# Altium schematic sheet Interfaces.SchDoc
size A; SheetNumber: 2; SheetTotal: 3
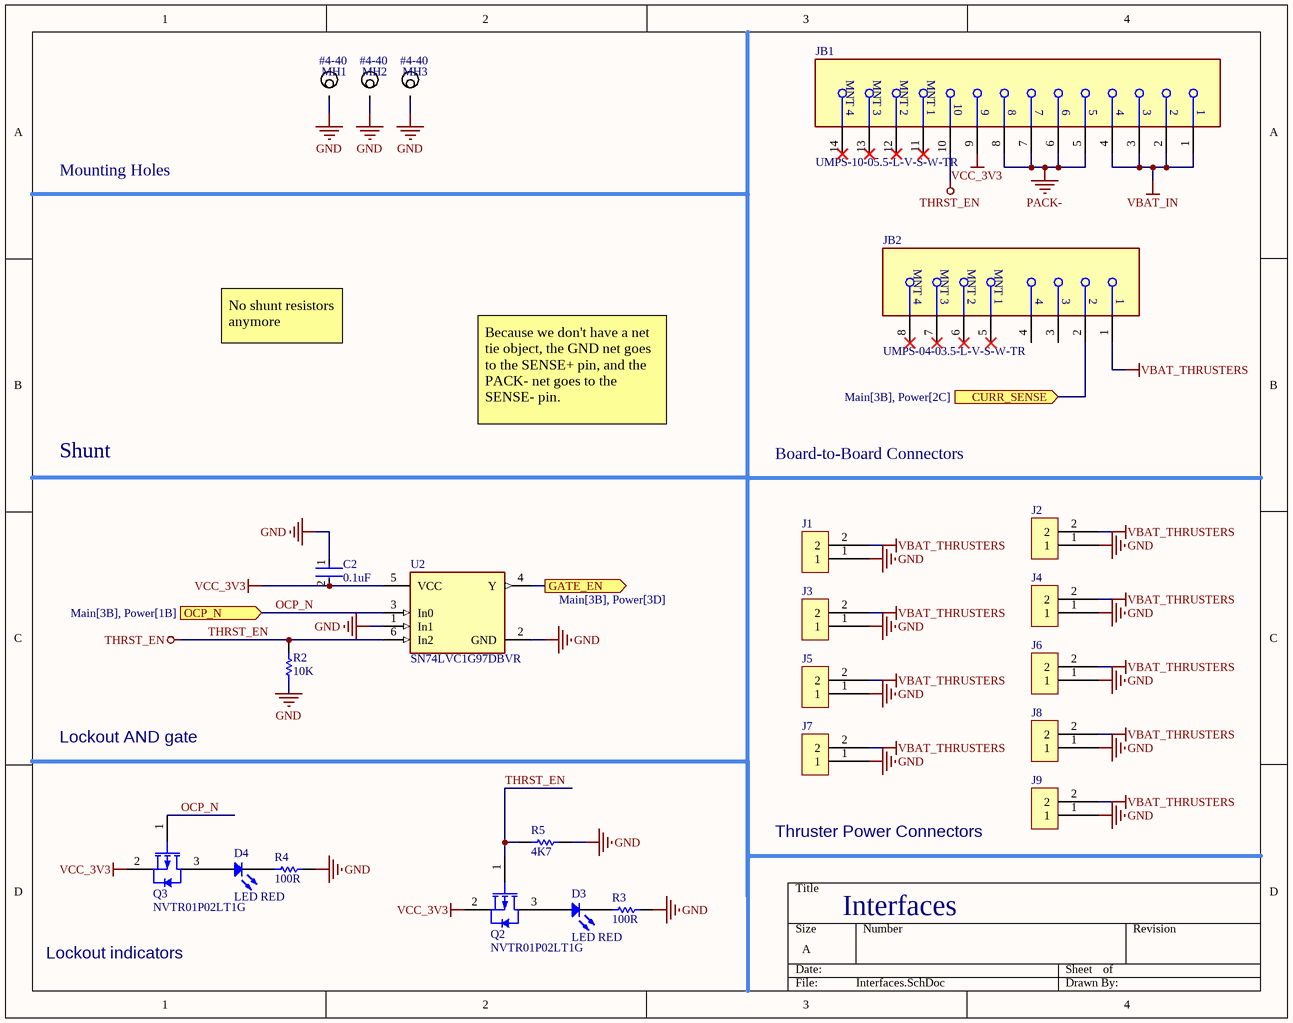
[diagram p0: Interfaces.SchDoc]

## Parts
C2  0.1uF  [FP-C0603C-CF-MFG]
D3  LED RED  [C0805]
D4  LED RED  [C0805]
J1  (no value)  [2-pin Megafit RA]
J2  (no value)  [2-pin Megafit RA]
J3  (no value)  [2-pin Megafit RA]
J4  (no value)  [2-pin Megafit RA]
J5  (no value)  [2-pin Megafit RA]
J6  (no value)  [2-pin Megafit RA]
J7  (no value)  [2-pin Megafit RA]
J8  (no value)  [2-pin Megafit RA]
J9  (no value)  [2-pin Megafit RA]
JB1  UMPS-10-05.5-L-V-S-W-TR  [FP-UMPS-10-05_5-L-V-S-W-T-MFG]
JB2  UMPS-04-03.5-L-V-S-W-TR  [FP-UMPS-04-03_5-L-V-S-W-T-MFG]
MH1  #4-40  [Mounting Hole #4-40]
MH2  #4-40  [Mounting Hole #4-40]
MH3  #4-40  [Mounting Hole #4-40]
Q2  NVTR01P02LT1G  [ONSC-SOT-23-3-318-08_V]
Q3  NVTR01P02LT1G  [ONSC-SOT-23-3-318-08_V]
R2  10K  [RESC0603(1608)_N]
R3  100R  [RESC1609X50X30NL10T20]
R4  100R  [RESC1609X50X30NL10T20]
R5  4K7  [0603]
U2  SN74LVC1G97DBVR  [FP-DBV0006A-MFG]

## Ports
CURR_SENSE (in, see Main[3B], Power[2C]), GATE_EN (out, see Main[3B], Power[3D]), OCP_N (in, see Main[3B], Power[1B])

## Nets
GND: C2.1 J1.1 J2.1 J3.1 J4.1 J5.1 J6.1 J7.1 J8.1 J9.1 MH1.0 MH2.0 MH3.0 R2.2 R3.2 R4.2 R5.1 U2.1(In1) U2.2(GND)
PACK-: JB1.5 JB1.6 JB1.7 JB1.8
THRST_EN: JB1.10 Q2.1(G) R2.1 R5.2 U2.6(In2)
VBAT_IN: JB1.1 JB1.2 JB1.3 JB1.4
VBAT_THRUSTERS: J1.2 J2.2 J3.2 J4.2 J5.2 J6.2 J7.2 J8.2 J9.2 JB2.1
VCC_3V3: C2.2 JB1.9 Q2.2(S) Q3.2(S) U2.5(VCC)
CURR_SENSE: JB2.2 ; port CURR_SENSE
GATE_EN: U2.4(Y) ; port GATE_EN
OCP_N: Q3.1(G) U2.3(In0) ; port OCP_N
NetD3_1: D3.1(K) R3.1
NetD3_2: D3.2(A) Q2.3(D)
NetD4_1: D4.1(K) R4.1
NetD4_2: D4.2(A) Q3.3(D)

Not connected (* = marked no-connect by the designer): JB1 11(MNT_1)* 12(MNT_2)* 13(MNT_3)* 14(MNT_4)*; JB2 3 4 5(MNT_1)* 6(MNT_2)* 7(MNT_3)* 8(MNT_4)*

## Notes on the sheet
- Mounting Holes
- No shunt resistors anymore
- Because we don't have a net tie object, the GND net goes to the SENSE+ pin, and the PACK- net goes to the SENSE- pin.
- Shunt
- Board-to-Board Connectors
- Lockout AND gate
- Thruster Power Connectors
- Lockout indicators
- Interfaces

## Library data of the parts
C2 = CMP-1035-02580-3: CAP CER 0.1UF 10V X7R 0603; Manufacturer Part Number: C0603C104K8RACTU; Manufacturer: KEMET; Tolerance: 0.1; Value: 0.10 μF; Material: Ceramic; Temperature Coefficient: 30ppm/°C; Automotive Grade: Grade 1; Digikey Description: CAP CER 0.1UF 10V X7R 0603; Temperature Range High: +125°C; RoHS: TRUE; ComponentLink2URL: https://api.kemet.com/component-edge/download/datasheet/C0603C100J5GACAUTO.pdf; Lead Free: Yes; Device Class L2: Capacitors; Mouser Description: Multilayer Ceramic Capacitors MLCC - SMD/SMT 10volts 0.1uF X7R 10%; Temperature: -55°C to +125°C; Category: Cap; Height: 0.87mm; Voltage Rating: 10 V; Device Class L3: Ceramic Capacitors; ComponentLink2Description: Datasheet; Automotive: Yes; Octopart: https://octopart.com/c0603c104k8ractu-kemet-145075; Temperature Characteristic: X7R; Device Class L1: Passive Components; Temperature Range Low: -55°C; Package: C0603C-CF; Capacitance: 0.10 μF
D3 D4 = LED0: led / LTST-C171KRKT; Manufacturer: Lite-On Inc.; Lens Color: Colorless; Lens Transparency: Clear; Millicandela Rating: 54mcd; Lens Style/Size: Rectangle with Flat Top, 1.40mm x 1.25mm; Voltage - Forward (Vf) (Typ): 2V; Current - Test: 20mA; Viewing Angle: 130°; Wavelength - Dominant: 631nm; Wavelength - Peak: 639nm; Supplier 1: Digi-Key; Supplier Part Number 1: 160-1427-1-ND; Manufacturer Part Number: LTST-C171KRKT; RoHS: RoHS Compliant; Category: Optoelectronics; Stock 1: 260544; Pricing 1: 1=0.31, 10=0.225, 25=0.1656, 100=0.1183, 250=0.0804, 500=0.07096, 1000=0.05558 (USD); Packaging: Cut Tape (CT); Part Status: Active; Color: Red; Mounting Type: Surface Mount; Features: -; Package / Case: 0805 (2012 Metric); Size / Dimension: 2.00mm L x 1.25mm W; Height (Max): 0.80mm; ComponentLink1URL: http://optoelectronics.liteon.com/upload/download/DS22-2000-109/LTST-C171KRKT.pdf; ComponentLink1Description: http://optoelectronics.liteon.com/upload/download/DS22-2000-109/LTST-C171KRKT.pdf
J1-J9 = 2-pin megafit
JB1 = CMP-02770-000036-1: CONN MPOWER 2MM FMALE 10POS GOLD; System: Connector
JB2 = CMP-02770-000027-1: CONN MPOWER 2MM FMALE 4POS GOLD
MH1-MH3 = Mounting Hole #4-40, Loose Fit: Mounting Hole for ANSI #4-40 w/ Flat Washer, Loose Fit; Datasheet: http://blogs.mentor.com/tom-hausherr/blog/tag/pcb-mounting-holes/
Q2 Q3 = CMP-1058-00752-1: Power MOSFET, -20 V, -1.3 A, P-Channel, 3-Pin SOT-23, Pb-Free, Tape and Reel; Manufacturer: On Semiconductor; Ciss Typ (pF): 225; Configuration: Single; Coss Typ (pF): 130; PD Max (W): 0.4; ID Max (A): 1.3; Crss Typ (pF): 55; VGS Max (V): 12; V(BR)DSS Min (V): 20; VGS(th) Max (V): 1.25; Qrr Typ (nC): 8.5; Channel Polarity: P Channel; ComponentLink1URL: http://www.onsemi.com/; PackageReference: SOT-23-3-318-08; RoHS: Pb-Free; ComponentLink1Description: Manufacturer URL; PackageDescription: 3-Pin Small Outline Transistor, Body 2.92 x 1.3 mm, Pitch 0.95 mm; ComponentLink3Description: Package Specification; ComponentLink2Description: Datasheet; Package Type: SOT-23-3; ComponentLink2URL: http://www.onsemi.cn/pub_link/Collateral/NTR1P02LT1-D.PDF; Packing: Tape and Reel; Mounting Technology: Surface Mount; ComponentLink3URL: http://www.onsemi.cn/pub_link/Collateral/318-08.PDF; PartNumber: NVTR01P02LT1G; PackageVersion: Rev. AP, 11/2009; DatasheetVersion: Rev. 13
R2 = CMP-1012-00098-1: 10K 0.1W 5% 0603 (1608 Metric)  SMD; Case-EIA: 0603; Value: 10000.00 Ohm; Case-Metric: 1608; Technology: SMT; Tolerance: 5 %; Power: 0.1 W
R3 R4 = CMP-1012-00050-2: 100R 0.1W 5%; Part Number: CRCW0603100RJNTA; Manufacturer: Vishay Dale
R5 = 4K7 0603: 4K7 0.1W 1% 0603 (1608 Metric)  SMD; Case-Metric: 1608; Value: 4700.00 Ohm; Case-EIA: 0603; Power: 0.1 W; Tolerance: 1 %; Technology: SMT; ComponentLink1Description: Link; ComponentLink1URL: https://www.digikey.com/en/products/detail/yageo/RC0603FR-074K7L/727212
U2 = CMP-0859-00234-4: IC CONFIG MULT-FUNC GATE SOT23-6; Manufacturer: Texas Instruments; Logic Function Desc: Dual; Min Supply Voltage: 1.65V; Number Of Inputs: 3; Nominal Supply Current: 10uA; Max Supply Voltage: 5.5V; Number Of Circuits: 1; Propagation Delay: 6.1ns; Standoff Height: 0mm; Max Junction Temp: +150°C; Category: IC; Device Class L3: Logic Gates; ComponentLink2Description: Datasheet; Ipc Land Pattern Name: SOT95P280X145-6; RoHS: TRUE; Temperature Range High: +125°C; Octopart: https://octopart.com/sn74lvc1g97dbvr-texas+instruments-464842; Package: DBV0006A; Device Class L2: Logic ICs; Temperature Range Low: -40°C; Ambient Temperature Range High: +125°C; Height: 1.45mm; Automotive: No; Lead Free: Yes; Mouser Description: Logic Gates Cnfgrble Mult Function Gate; Temperature: -40°C to +125°C; Number Of Outputs: 1; Digikey Description: IC CONFIG MULT-FUNC GATE SOT23-6; Manufacturer Part Number: SN74LVC1G97DBVR; Device Class L1: Integrated Circuits (ICs); Ambient Temperature Range Low: -40°C; ComponentLink2URL: http://www.ti.com/lit/ds/symlink/sn74lvc1g97.pdf